# Altium project CTR-Lower-Main-Board-Rev-B.PrjPcb (part 3 of 3)
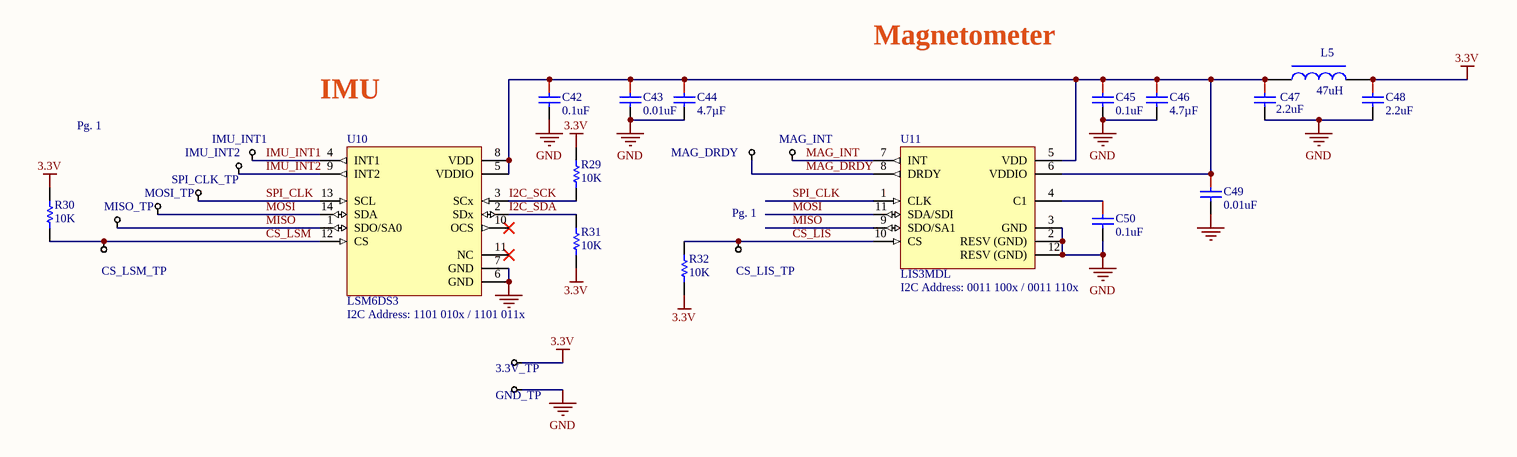
[diagram p3: CTR-Lower-Main-Board-Rev-B-Sensors-4.SchDoc]

## Nets that join several sheets
3.3V: CTR-Lower-Main-Board-Rev-B-BTLE-1 (9 pins), CTR-Lower-Main-Board-Rev-B-Power-3 (C31.1 U8.5), CTR-Lower-Main-Board-Rev-B-Sensors-4 (7 pins)
GND: CTR-Lower-Main-Board-Rev-B-BTLE-1 (21 pins), CTR-Lower-Main-Board-Rev-B-Power-3 (45 pins), CTR-Lower-Main-Board-Rev-B-Sensors-4 (15 pins)
BAT_MON1: CTR-Lower-Main-Board-Rev-B-BTLE-1 (U1.4), CTR-Lower-Main-Board-Rev-B-Power-3 (C27.1 R11.1 R15.1)
BAT_MON2: CTR-Lower-Main-Board-Rev-B-BTLE-1 (U1.5), CTR-Lower-Main-Board-Rev-B-Power-3 (C25.1 R9.1 R13.1)
BAT_MON3: CTR-Lower-Main-Board-Rev-B-BTLE-1 (U1.37), CTR-Lower-Main-Board-Rev-B-Power-3 (C26.1 R10.1 R14.1)
CS_LIS: CTR-Lower-Main-Board-Rev-B-BTLE-1 (U1.21), CTR-Lower-Main-Board-Rev-B-Sensors-4 (CS_LIS_TP.1 R32.2 U11.10)
CS_LSM: CTR-Lower-Main-Board-Rev-B-BTLE-1 (U1.12), CTR-Lower-Main-Board-Rev-B-Sensors-4 (CS_LSM_TP.1 R30.1 U10.12)
I2C_DAT: CTR-Lower-Main-Board-Rev-B-BTLE-1 (U1.39), CTR-Lower-Main-Board-Rev-B-Power-3 (CN2.4 I2C_SDA.1)
I2C_SCK: CTR-Lower-Main-Board-Rev-B-BTLE-1 (U1.22), CTR-Lower-Main-Board-Rev-B-Power-3 (CN2.5 I2C_SCL.1), CTR-Lower-Main-Board-Rev-B-Sensors-4 (R29.1 U10.3)
IMU_INT1: CTR-Lower-Main-Board-Rev-B-BTLE-1 (U1.7), CTR-Lower-Main-Board-Rev-B-Sensors-4 (IMU_INT1.1 U10.4)
IMU_INT2: CTR-Lower-Main-Board-Rev-B-BTLE-1 (U1.8), CTR-Lower-Main-Board-Rev-B-Sensors-4 (IMU_INT2.1 U10.9)
MAG_DRDY: CTR-Lower-Main-Board-Rev-B-BTLE-1 (U1.38), CTR-Lower-Main-Board-Rev-B-Sensors-4 (MAG_DRDY.1 U11.8)
MAG_INT: CTR-Lower-Main-Board-Rev-B-BTLE-1 (U1.6), CTR-Lower-Main-Board-Rev-B-Sensors-4 (MAG_INT.1 U11.7)
MISO: CTR-Lower-Main-Board-Rev-B-BTLE-1 (U1.9), CTR-Lower-Main-Board-Rev-B-Sensors-4 (MISO_TP.1 U10.1 U11.9)
MOSI: CTR-Lower-Main-Board-Rev-B-BTLE-1 (U1.10), CTR-Lower-Main-Board-Rev-B-Sensors-4 (MOSI_TP.1 U10.14 U11.11)
POWER_OFF: CTR-Lower-Main-Board-Rev-B-BTLE-1 (U1.41), CTR-Lower-Main-Board-Rev-B-Power-3 (D5.1)
RESET: CTR-Lower-Main-Board-Rev-B-BTLE-1 (U1.24), CTR-Lower-Main-Board-Rev-B-Power-3 (CN2.6 RESET.1)
SPI_CLK: CTR-Lower-Main-Board-Rev-B-BTLE-1 (U1.11), CTR-Lower-Main-Board-Rev-B-Sensors-4 (SPI_CLK_TP.1 U10.13 U11.1)
UART_RX: CTR-Lower-Main-Board-Rev-B-BTLE-1 (U1.42), CTR-Lower-Main-Board-Rev-B-Power-3 (CN2.2 R7.2 UART_RX.1)
UART_TX: CTR-Lower-Main-Board-Rev-B-BTLE-1 (U1.43), CTR-Lower-Main-Board-Rev-B-Power-3 (CN2.3 R5.2 UART_TX.1)